# EAGLE design VFD-IV-25-5x7x2 (EAGLE 7.2.0)
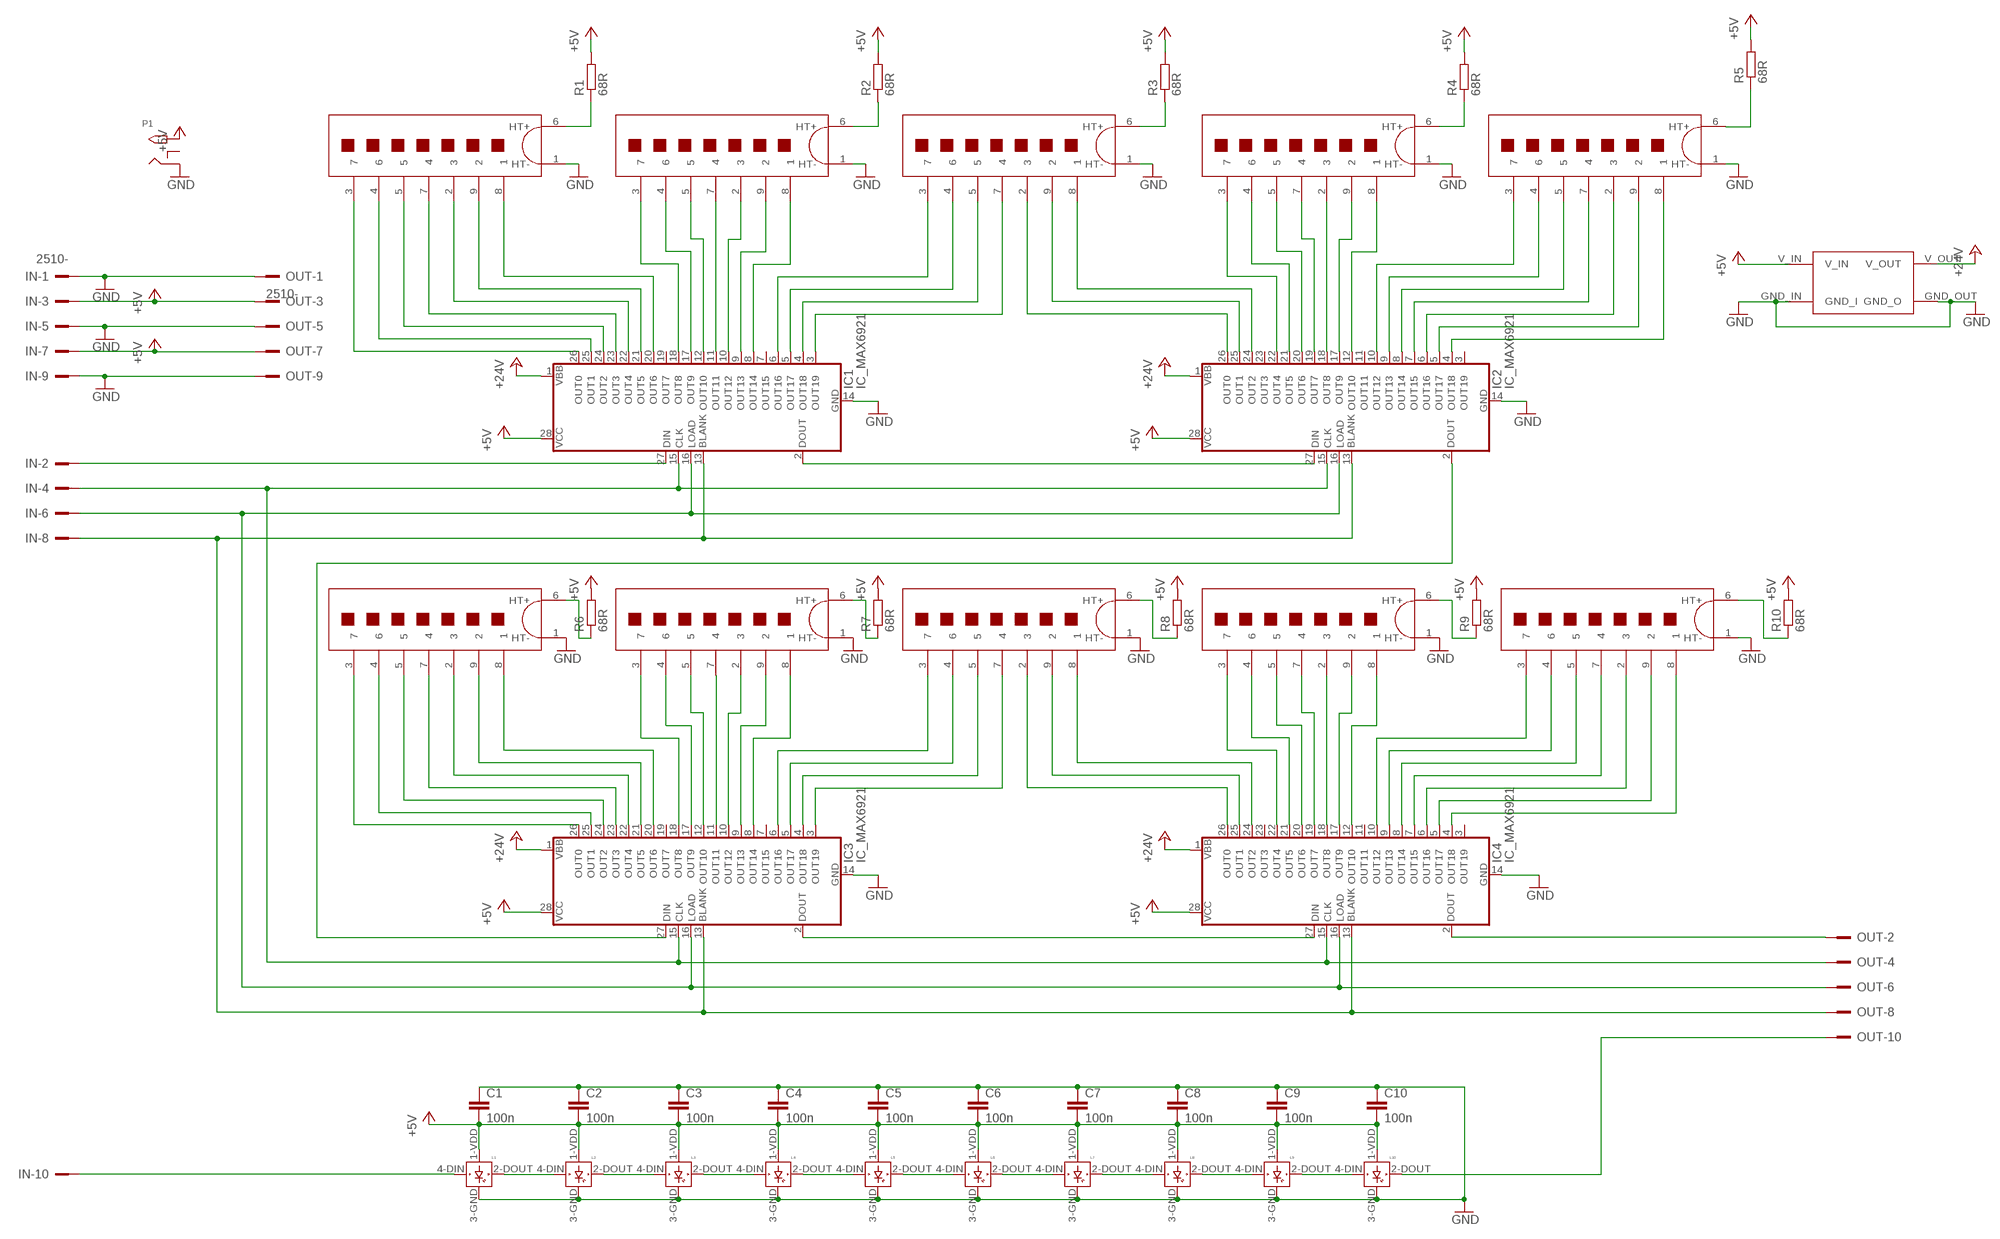
[diagram p0: schematic, sheet 1]

## Parts
1  IV-25_DISP  [IV-25]
2  IV-25_DISP  [IV-25]
3  IV-25_DISP  [IV-25]
4  IV-25_DISP  [IV-25]
5  IV-25_DISP  [IV-25]
6  IV-25_DISP  [IV-25]
7  IV-25_DISP  [IV-25]
8  IV-25_DISP  [IV-25]
9  IV-25_DISP  [IV-25]
10  IV-25_DISP  [IV-25]
C1  100n  C-EU050-025X075  [C050-025X075]
C2  100n  C-EU050-025X075  [C050-025X075]
C3  100n  C-EU050-025X075  [C050-025X075]
C4  100n  C-EU050-025X075  [C050-025X075]
C5  100n  C-EU050-025X075  [C050-025X075]
C6  100n  C-EU050-025X075  [C050-025X075]
C7  100n  C-EU050-025X075  [C050-025X075]
C8  100n  C-EU050-025X075  [C050-025X075]
C9  100n  C-EU050-025X075  [C050-025X075]
C10  100n  C-EU050-025X075  [C050-025X075]
IC1  IC_MAX6921  [S28]
IC2  IC_MAX6921  [S28]
IC3  IC_MAX6921  [S28]
IC4  IC_MAX6921  [S28]
IN  2510-  [PAK100/2500-10]
L1  WS2812B  [WS2812B]
L2  WS2812B  [WS2812B]
L3  WS2812B  [WS2812B]
L4  WS2812B  [WS2812B]
L5  WS2812B  [WS2812B]
L6  WS2812B  [WS2812B]
L7  WS2812B  [WS2812B]
L8  WS2812B  [WS2812B]
L9  WS2812B  [WS2812B]
L10  WS2812B  [WS2812B]
OUT  2510-  [PAK100/2500-10]
P1  2.1MMJACKTHM  [PJ-102A]
R1  68R  R-EU_0207/10  [0207/10]
R2  68R  R-EU_0207/10  [0207/10]
R3  68R  R-EU_0207/10  [0207/10]
R4  68R  R-EU_0207/10  [0207/10]
R5  68R  R-EU_0207/10  [0207/10]
R6  68R  R-EU_0207/10  [0207/10]
R7  68R  R-EU_0207/10  [0207/10]
R8  68R  R-EU_0207/10  [0207/10]
R9  68R  R-EU_0207/10  [0207/10]
R10  68R  R-EU_0207/10  [0207/10]
U$11  STEP_UP_MODULE  [STEP_UP_MODULE]

## Nets
+5V [power]: C1.2 C2.2 C3.2 C4.2 C5.2 C6.2 C7.2 C8.2 C9.2 C10.2 IC1.28(VCC) IC2.28(VCC) IC3.28(VCC) IC4.28(VCC) IN.3 IN.7 L1.1-VDD(VDD) L2.1-VDD(VDD) L3.1-VDD(VDD) L4.1-VDD(VDD) L5.1-VDD(VDD) L6.1-VDD(VDD) L7.1-VDD(VDD) L8.1-VDD(VDD) L9.1-VDD(VDD) L10.1-VDD(VDD) OUT.3 OUT.7 P1.TIP R1.2 R2.2 R3.2 R4.2 R5.2 R6.2 R7.2 R8.2 R9.2 R10.2 U$11.V_IN
+24V [power_lo]: IC1.1(VBB) IC2.1(VBB) IC3.1(VBB) IC4.1(VBB) U$11.V_OUT
GND [power]: 1.1(HT-) 2.1(HT-) 3.1(HT-) 4.1(HT-) 5.1(HT-) 6.1(HT-) 7.1(HT-) 8.1(HT-) 9.1(HT-) 10.1(HT-) C1.1 C2.1 C3.1 C4.1 C5.1 C6.1 C7.1 C8.1 C9.1 C10.1 IC1.14(GND) IC2.14(GND) IC3.14(GND) IC4.14(GND) IN.1 IN.5 IN.9 L1.3-GND(GND) L2.3-GND(GND) L3.3-GND(GND) L4.3-GND(GND) L5.3-GND(GND) L6.3-GND(GND) L7.3-GND(GND) L8.3-GND(GND) L9.3-GND(GND) L10.3-GND(GND) OUT.1 OUT.5 OUT.9 P1.RING U$11.GND_IN(GND_I) U$11.GND_OUT(GND_O)
N$1: L1.2-DOUT(DOUT) L2.4-DIN(DIN)
N$2: L2.2-DOUT(DOUT) L3.4-DIN(DIN)
N$3: L3.2-DOUT(DOUT) L4.4-DIN(DIN)
N$4: L4.2-DOUT(DOUT) L5.4-DIN(DIN)
N$5: L5.2-DOUT(DOUT) L6.4-DIN(DIN)
N$6: L6.2-DOUT(DOUT) L7.4-DIN(DIN)
N$7: L7.2-DOUT(DOUT) L8.4-DIN(DIN)
N$8: L8.2-DOUT(DOUT) L9.4-DIN(DIN)
N$9: L9.2-DOUT(DOUT) L10.4-DIN(DIN)
N$10: 1.3 IC1.26(OUT0)
N$11: 1.4 IC1.25(OUT1)
N$12: 1.5 IC1.24(OUT2)
N$13: 1.7 IC1.23(OUT3)
N$14: 1.2 IC1.22(OUT4)
N$15: 1.9 IC1.21(OUT5)
N$16: 1.8 IC1.20(OUT6)
N$17: 2.3 IC1.18(OUT8)
N$18: 2.4 IC1.17(OUT9)
N$19: 2.5 IC1.12(OUT10)
N$20: 2.7 IC1.11(OUT11)
N$21: 2.2 IC1.10(OUT12)
N$22: 2.9 IC1.9(OUT13)
N$23: 2.8 IC1.8(OUT14)
N$24: 3.3 IC1.6(OUT16)
N$25: 3.4 IC1.5(OUT17)
N$26: 4.3 IC2.22(OUT4)
N$27: 4.4 IC2.21(OUT5)
N$28: 3.5 IC1.4(OUT18)
N$29: 3.7 IC1.3(OUT19)
N$30: 3.2 IC2.26(OUT0)
N$31: 3.9 IC2.25(OUT1)
N$32: 3.8 IC2.24(OUT2)
N$33: 4.5 IC2.20(OUT6)
N$34: 4.7 IC2.19(OUT7)
N$35: 4.2 IC2.18(OUT8)
N$36: 4.9 IC2.17(OUT9)
N$37: 4.8 IC2.12(OUT10)
N$38: 5.3 IC2.10(OUT12)
N$39: 5.4 IC2.9(OUT13)
N$40: 5.5 IC2.8(OUT14)
N$41: 5.7 IC2.7(OUT15)
N$42: 5.2 IC2.6(OUT16)
N$43: 5.9 IC2.5(OUT17)
N$44: 5.8 IC2.4(OUT18)
N$45: 6.3 IC3.26(OUT0)
N$46: 6.4 IC3.25(OUT1)
N$47: 6.5 IC3.24(OUT2)
N$48: 6.7 IC3.23(OUT3)
N$49: 6.2 IC3.22(OUT4)
N$50: 6.9 IC3.21(OUT5)
N$51: 6.8 IC3.20(OUT6)
N$52: 7.3 IC3.18(OUT8)
N$53: 7.4 IC3.17(OUT9)
N$54: 7.5 IC3.12(OUT10)
N$55: 7.7 IC3.11(OUT11)
N$56: 7.2 IC3.10(OUT12)
N$57: 7.9 IC3.9(OUT13)
N$58: 7.8 IC3.8(OUT14)
N$59: 8.3 IC3.6(OUT16)
N$60: 8.4 IC3.5(OUT17)
N$61: 8.5 IC3.4(OUT18)
N$62: 8.7 IC3.3(OUT19)
N$63: 8.2 IC4.26(OUT0)
N$64: 8.9 IC4.25(OUT1)
N$65: 8.8 IC4.24(OUT2)
N$66: 9.3 IC4.22(OUT4)
N$67: 9.4 IC4.21(OUT5)
N$68: 9.5 IC4.20(OUT6)
N$69: 9.7 IC4.19(OUT7)
N$70: 9.2 IC4.18(OUT8)
N$71: 9.9 IC4.17(OUT9)
N$72: 9.8 IC4.12(OUT10)
N$73: 10.3 IC4.10(OUT12)
N$74: 10.4 IC4.9(OUT13)
N$75: 10.5 IC4.8(OUT14)
N$76: 10.7 IC4.7(OUT15)
N$77: 10.2 IC4.6(OUT16)
N$78: 10.9 IC4.5(OUT17)
N$79: 10.8 IC4.4(OUT18)
N$80: IC1.2(DOUT) IC2.27(DIN)
N$81: IC2.2(DOUT) IC3.27(DIN)
N$82: IC3.2(DOUT) IC4.27(DIN)
N$83: IC1.27(DIN) IN.2
N$84: IN.10 L1.4-DIN(DIN)
N$85: L10.2-DOUT(DOUT) OUT.10
N$86: IC4.2(DOUT) OUT.2
N$87: IC1.15(CLK) IC2.15(CLK) IC3.15(CLK) IC4.15(CLK) IN.4 OUT.4
N$88: IC1.16(LOAD) IC2.16(LOAD) IC3.16(LOAD) IC4.16(LOAD) IN.6 OUT.6
N$89 [power_lo]: 5.6(HT+) R5.1
N$90: IC1.13(BLANK) IC2.13(BLANK) IC3.13(BLANK) IC4.13(BLANK) IN.8 OUT.8
N$91 [power_lo]: 4.6(HT+) R4.1
N$92 [power_lo]: 3.6(HT+) R3.1
N$93 [power_lo]: 2.6(HT+) R2.1
N$94 [power_lo]: 1.6(HT+) R1.1
N$95 [power_lo]: 9.6(HT+) R9.1
N$96 [power_lo]: 10.6(HT+) R10.1
N$97 [power_lo]: 8.6(HT+) R8.1
N$98 [power_lo]: 7.6(HT+) R7.1
N$99 [power_lo]: 6.6(HT+) R6.1
Unconnected: IC1.7(OUT15) IC1.19(OUT7) IC2.3(OUT19) IC2.11(OUT11) IC2.23(OUT3) IC3.7(OUT15) IC3.19(OUT7) IC4.3(OUT19) IC4.11(OUT11) IC4.23(OUT3) P1.RING_SW

## Library data of the parts
1-10 = vfd:IV-25_DISP
C1-C10 = resistor:C-EU: CAPACITOR, European symbol
IC1-IC4 = rob:IC_MAX6921: 20-outputs, 76V, serial VFD driver Dangerousprototypes.com
IN OUT = con-3m:2510-: 3M (TM) Pak 100 4-Wall Header Source: 3M; MF: 3M; MPN: 2510-6002UB; OC_FARNELL: 9838244; OC_NEWARK: 46F4725
L1-L10 = adafruit:WS2812B
P1 = adafruit:2.1MMJACK: 2.1mm x 5.5mm THM DC jack with internal switch. Digikey part #PJ-102A, 4UCON part #05537 2.1mm x 5.5mm SMT DC jack with internal switch. Digikey part #PJ-002A-SMT, 4UCON part #03267 By microbuilder.eu & adafruit.com
R1-R10 = resistor:R-EU_: RESISTOR, European symbol
U$11 = vfd:STEP_UP_MODULE

## Net classes
1 power: width 1 mm
2 power_lo: width 0.5 mm

## Board
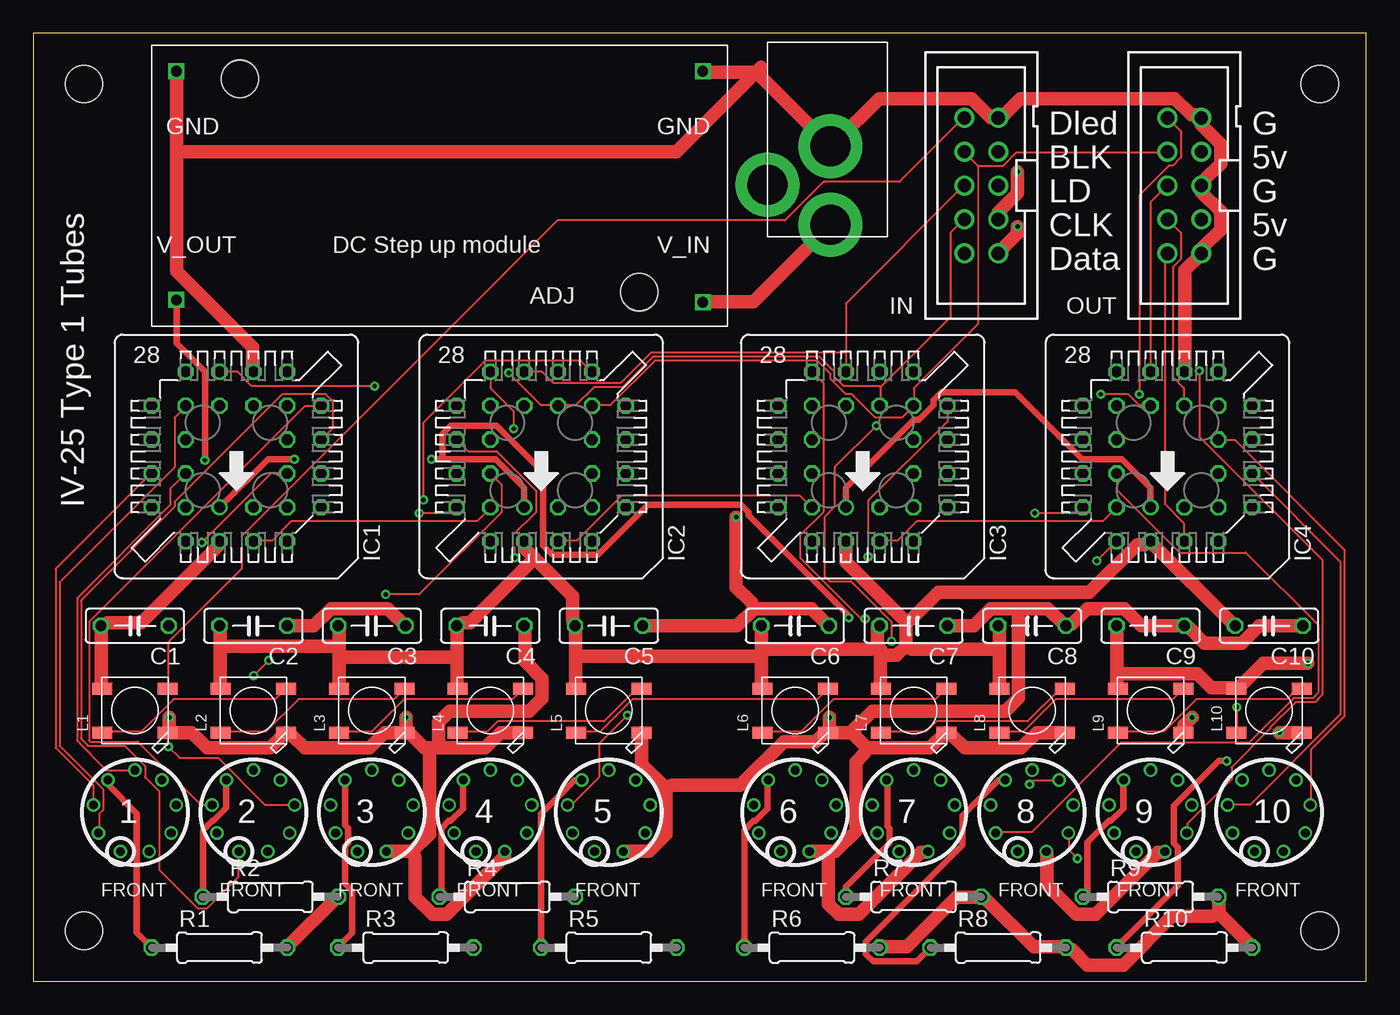
[diagram p1: board, top side]
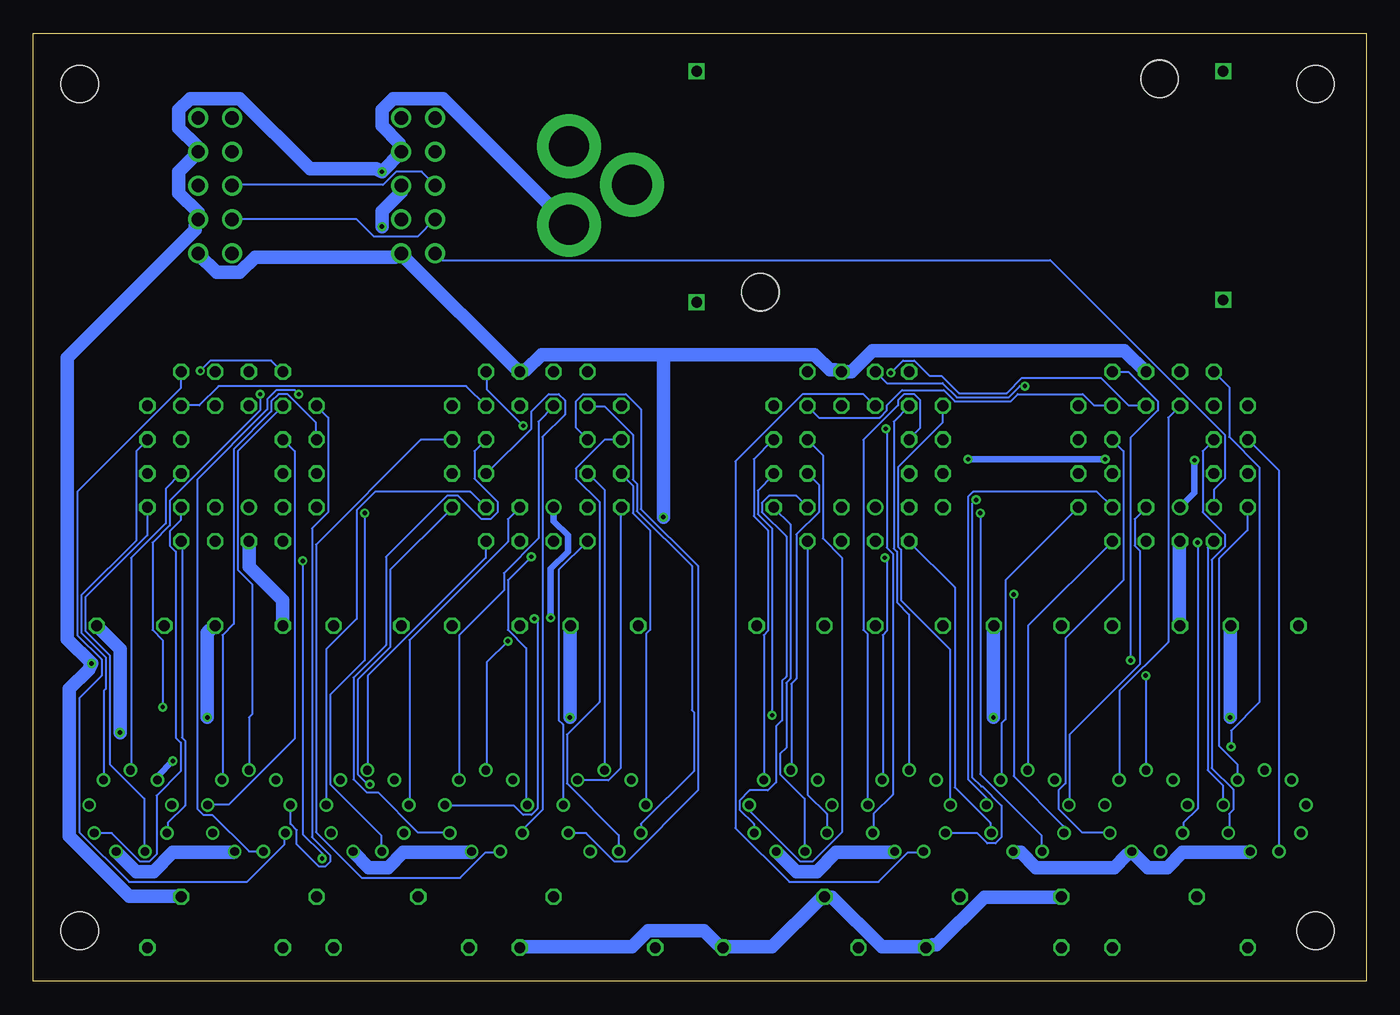
[diagram p2: board, bottom side, seen from below]

Size 100 x 71.11 mm. Coordinates in mm from the lower left corner, seen from the top.
Outline: 0,0 100,0 100,71.11 0,71.11 0,0
Copper layers (1*16): Top 0.0356mm / dielectric 1.5011mm / Bottom 0.0356mm
Design rules "oshpark-2layer": minimum track width 6mil, minimum drill 13mil, track to track 6mil, track to pad 6mil, pad to pad 6mil, via to via 6mil, smd to smd 6mil, copper to edge 15mil, drill to drill 6mil, minimum pad ring 7mil, minimum via ring 7mil, stop-mask expansion 4mil, vias tented up to drill 0mil, thermal gap 10mil
Holes 2.8 mm at 3.81,67.31 96.52,67.31 3.81,3.81 96.52,3.81 15.5,67.71 45.45,51.71

### Footprints (pad centres in the part's own frame; a part is rotated, then mirrored left to right if it is on the bottom)
IV-25 = drill 0.65: 1 1.076,-2.955; 2 2.724,-1.572; 3 3.097,0.546; 4 2.022,2.409; 5 0,3.145; 6 -2.022,2.409; 7 -3.097,0.546; 8 -2.724,-1.572; 9 -1.076,-2.955
C050-025X075 = drill 0.813 octagon: 1 -2.54,0; 2 2.54,0
S28 = drill 0.813: 1 1.27,3.81 | drill 0.813 octagon: 2 -1.27,6.35; 3 -1.27,3.81; 4 -3.81,6.35; 5 -6.35,3.81; 6 -3.81,3.81; 7 -6.35,1.27; 8 -3.81,1.27; 9 -6.35,-1.27; 10 -3.81,-1.27; 11 -6.35,-3.81; 12 -3.81,-6.35; 13 -3.81,-3.81; 14 -1.27,-6.35; 15 -1.27,-3.81; 16 1.27,-6.35; 17 1.27,-3.81; 18 3.81,-6.35; 19 6.35,-3.81; 20 3.81,-3.81; 21 6.35,-1.27; 22 3.81,-1.27; 23 6.35,1.27; 24 3.81,1.27; 25 6.35,3.81; 26 3.81,6.35; 27 3.81,3.81; 28 1.27,6.35
PAK100/2500-10 = drill 1 pad 1.422: 1 -5.08,-1.27; 2 -5.08,1.27; 3 -2.54,-1.27; 4 -2.54,1.27; 5 0,-1.27; 6 0,1.27; 7 2.54,-1.27; 8 2.54,1.27; 9 5.08,-1.27; 10 5.08,1.27
WS2812B = smd 1.5 x 0.9: 1-VDD 2.45,-1.65; 2-DOUT 2.45,1.65; 3-GND -2.45,1.65; 4-DIN -2.45,-1.65
PJ-102A = drill 3 pad 4.8: RING 0.1,-3.39; RING_SW -4.6,-6.29; TIP 0.1,-9.29
0207/10 = drill 0.813 octagon: 1 -5.08,0; 2 5.08,0
STEP_UP_MODULE = drill 0.8 square: GND_IN -19.749,-8.573; GND_OUT 19.749,-8.573; V_IN -19.749,8.753; V_OUT 19.749,8.573 | hole 2.8: -14.986,8.001; 14.986,-8.001

### Placement (x,y rotation side)
1  7.62,12.7 0 top
2  16.51,12.7 0 top
3  25.4,12.7 0 top
4  34.29,12.7 0 top
5  43.18,12.7 0 top
6  57.15,12.7 0 top
7  66.04,12.7 0 top
8  74.93,12.7 0 top
9  83.82,12.7 0 top
10  92.71,12.7 0 top
C1  7.62,26.67 180 top
C2  16.51,26.67 180 top
C3  25.4,26.67 180 top
C4  34.29,26.67 180 top
C5  43.18,26.67 180 top
C6  57.15,26.67 180 top
C7  66.04,26.67 180 top
C8  74.93,26.67 180 top
C9  83.82,26.67 180 top
C10  92.71,26.67 180 top
IC1  15.24,39.37 180 top
IC2  38.1,39.37 180 top
IC3  62.23,39.37 180 top
IC4  85.09,39.37 180 top
IN  71.12,59.69 90 top
L1  7.62,20.32 180 top
L2  16.51,20.32 180 top
L3  25.4,20.32 180 top
L4  34.29,20.32 180 top
L5  43.18,20.32 180 top
L6  57.15,20.32 180 top
L7  66.04,20.32 180 top
L8  74.93,20.32 180 top
L9  83.82,20.32 180 top
L10  92.71,20.32 180 top
OUT  86.36,59.69 90 top
P1  59.69,66.04 0 top
R1  13.97,2.54 0 top
R2  17.78,6.35 0 top
R3  27.94,2.54 0 top
R4  35.56,6.35 0 top
R5  43.18,2.54 0 top
R6  58.42,2.54 0 top
R7  66.04,6.35 0 top
R8  72.39,2.54 0 top
R9  83.82,6.35 0 top
R10  86.36,2.54 0 top
U$11  30.48,59.69 180 top

### Tracks (layer width: path | path; a pad name or v marks a point on that pad's centre or on a via)
+5V  (via drill 0.33)
  Top 1: 88.92,5.11 88.92,6.33 R9.2 | 88.92,5.11 91.44,2.59 R10.2 | R6.2 63.55,2.59 65.53,2.59 69.27,6.33 71.09,6.33 R7.2 71.55,6.1 75.06,2.59 77.42,2.59 R8.2 77.95,2.36 79.1,1.22 81.76,1.22 85.42,4.88 88.47,4.88 88.92,5.11 | R1.2 19.05,2.59 22.86,6.4 R2.2 | IN.3 72.39,57.68 73.84,59.13 v73.84,60.73 | U$11.V_IN 50.29,50.98 54.03,50.98 59.74,56.69 P1.TIP | L1.1-VDD 5.11,22.02 5.11,26.67 C1.2 5.56,26.9 8.08,26.9 13.95,32.77 13.95,32.99 IC1.28 | 14.02,25.15 14.02,26.67 C2.2 | 14.02,25.15 14.02,22.02 L2.1-VDD | 22.94,25.15 22.94,26.59 C3.2 | 22.94,25.15 22.94,24.31 | 22.94,24.31 22.94,22.02 L3.1-VDD | 31.77,24.31 31.77,26.67 C4.2 32.23,26.9 32.77,26.9 37.6,31.74 | 31.77,24.31 31.77,22.02 L4.1-VDD | 31.77,24.31 22.94,24.31 | 40.69,24.38 40.69,26.67 C5.2 40.46,27.13 40.46,28.88 37.6,31.74 | 40.69,24.38 40.69,22.02 L5.1-VDD | 37.6,31.74 36.88,32.46 36.88,32.99 IC2.28 | 22.94,25.15 14.02,25.15 | 81.31,23.09 81.31,26.67 C9.2 | 81.31,23.09 81.31,22.02 L9.1-VDD | 81.31,23.09 87.33,23.09 88.39,22.02 90.22,22.02 L10.1-VDD 90.68,22.25 92.28,23.85 v95.63,23.85 | C10.2 90.14,26.67 83.82,32.99 IC4.28 83.36,32.77 82.83,32.77 79.25,29.18 67.89,29.18 65.91,27.2 65.46,26.98 | 72.47,24.92 72.47,26.59 C8.2 | 72.47,24.92 72.47,22.02 L8.1-VDD | 54.63,24.92 54.63,26.67 C6.2 | 54.63,24.92 54.63,24.38 | 54.63,24.38 54.63,22.02 L6.1-VDD | 63.55,24.46 63.55,24.92 63.32,25.15 | 63.55,24.46 63.55,22.02 L7.1-VDD | 63.32,25.15 63.32,26.52 63.48,26.67 C7.2 | IC3.28 60.96,31.47 65.46,26.98 | 65.46,25.15 65.46,26.98 | 65.46,25.15 64.77,24.46 63.55,24.46 | 54.63,24.92 62.87,24.92 63.32,25.15 | 72.47,24.92 65.91,24.92 65.46,25.15
  Top 1: 54.63,24.38 40.69,24.38
  Bottom 1: R2.2 22.86,6.33 28.65,6.33 32.23,2.74 32.54,2.74 R3.2 33.07,2.59 36.35,2.59 40.08,6.33 40.62,6.33 R4.2 41.07,6.1 44.58,2.59 48.23,2.59 R5.2 48.69,2.82 49.68,3.81 53.87,3.81 55.09,2.59 63.48,2.59 R6.2 | P1.TIP 59.82,56.77 69.27,66.22 73,66.22 73.84,65.38 73.84,64.16 72.54,62.87 72.54,62.71 IN.7 72.39,62.18 v73.84,60.73 74.3,60.96 79.25,60.96 84.51,66.22 88.24,66.22 89.08,65.38 89.08,64.01 87.78,62.71 OUT.7 87.63,62.18 89.08,60.73 89.08,59.13 87.63,57.68 OUT.3 87.86,56.69 87.86,56.39 97.46,46.79 97.46,25.68 v95.63,23.85 95.86,23.39 97.31,21.95 97.31,10.9 92.81,6.4 88.92,6.4 R9.2 | IC1.28 14.02,32.99 14.02,26.67 C2.2 | IC4.28 83.82,31.09 81.31,28.57 81.31,26.67 C9.2
+24V  (via drill 0.33)
  Top 0.5: IC3.1 60.96,37.03 66.06,42.14 66.45,42.14 67.51,43.2 67.51,43.59 68.12,44.2 73.69,44.2 78.72,39.17 81.69,39.17 83.82,37.03 IC4.1 | v12.88,39.09 12.88,45.72 10.74,47.85 10.74,51.05 U$11.V_OUT | v29.87,39.17 30.71,39.17 | 30.71,39.17 34.67,39.17 36.8,37.03 36.8,35.59 IC2.1 | v19.58,39.17 17.6,39.17 14.02,35.59 IC1.1 | v61.19,27.28 61.19,27.43 53.65,34.98 53.65,35.2 53.11,35.74 46.1,35.74 42.37,32 38.94,32 38.25,32.69 38.25,38.18 34.75,41.68 31.32,41.68 30.71,41.07 30.71,39.17
  Bottom 0.5: v12.88,39.09 12.88,36.65 IC1.1 | v19.58,39.17 v29.87,39.17 | IC3.1 60.96,34.52 59.89,33.45 59.89,32.23 61.19,30.94 v61.19,27.28
GND  (via drill 0.33)
  Top 1: U$11.GND_OUT 10.74,68.2 10.74,53.26 16.46,47.55 16.46,45.72 IC1.14 | v73.84,56.62 73.84,56.08 72.39,54.63 IN.1 | IC4.14 86.41,45.72 86.41,53.34 87.63,54.56 OUT.1 87.78,55.09 89.08,56.39 89.08,57.76 87.63,59.21 OUT.5 87.86,60.12 89.08,61.34 89.08,62.79 87.63,64.24 OUT.9 87.17,65 86.87,65 85.65,66.22 74.07,66.22 72.85,65 IN.9 71.86,64.77 70.41,66.22 63.48,66.22 60.2,62.94 P1.RING 59.74,62.71 54.25,68.2 50.29,68.2 U$11.GND_IN | 47.47,14.48 45.64,16.31 45.64,18.67 L5.3-GND | 47.47,14.48 47.47,11.05 46.18,9.75 44.27,9.75 5.1 | C2.1 21.03,26.67 22.33,27.96 26.59,27.96 27.89,26.67 C3.1 | 10.21,18.67 11.89,18.67 13.03,17.53 17.75,17.53 18.9,18.67 L2.3-GND 19.43,18.44 20.34,17.53 25.22,17.53 26.36,18.67 27.81,18.67 | 10.21,18.67 10.13,18.67 L1.3-GND | 27.81,18.67 L3.3-GND 28.35,18.52 29.34,17.53 29.72,17.53 | 29.72,17.53 30.4,17.53 | 30.4,17.53 33.91,17.53 35.05,18.67 36.73,18.67 L4.3-GND | 10.21,18.67 v10.21,19.81 | 30.4,17.53 30.4,19.43 31.24,20.27 37.19,20.27 38.18,21.26 38.18,22.71 36.88,24 36.88,26.67 C4.1 | v27.96,19.81 27.96,19.13 27.81,18.67 | 28.42,9.75 26.52,9.75 3.1 | 28.42,9.75 29.72,11.05 29.72,17.53 | 4.1 35.36,9.68 35.36,9.37 31.01,5.03 29.95,5.03 28.65,6.33 28.65,9.3 28.42,9.75 | v93.5,18.67 95.1,18.67 L10.3-GND | v86.94,19.81 86.33,19.2 86.33,18.75 L9.3-GND | C7.1 70.56,26.67 71.86,27.96 73.91,27.96 | 73.91,27.96 76.12,27.96 77.42,26.67 C8.1 77.95,26.82 79.1,27.96 81.84,27.96 83.13,26.67 C9.1 86.79,26.44 87.86,25.38 90.68,25.38 91.97,26.67 C10.1 | C5.1 52.81,26.67 54.1,27.96 | 54.1,27.96 58.37,27.96 59.66,26.67 C6.1 | 61.42,18.67 59.74,18.67
  Top 1: 59.74,18.67 59.66,18.67 L6.3-GND 59.13,18.44 58.67,17.98 56.31,17.98 53.03,14.71 47.93,14.71 47.47,14.48 | 62.56,17.53 61.42,18.67 | 62.56,17.53 67.28,17.53 68.43,18.67 L7.3-GND 68.96,18.44 69.88,17.53 74.14,17.53 75.29,18.67 77.34,18.67 L8.3-GND | 59.66,9.75 60.2,9.75 61.72,11.28 61.72,16.46 62.33,17.07 62.56,17.53 | 59.66,9.75 58.29,9.75 6.1 | 59.66,9.75 59.66,5.79 60.43,5.03 61.95,5.03 66.6,9.68 67.06,9.68 7.1 | 9.1 84.89,9.68 84.35,9.68 79.7,5.03 78.26,5.03 76.05,7.24 76.05,9.68 8.1 | 59.74,18.67 v59.74,19.81 | 73.91,27.96 73.91,21.26 72.92,20.27 62.94,20.27 61.72,19.05 61.42,18.67 | v52.73,34.82 52.73,29.57 53.87,28.42 54.1,27.96
  Bottom 1: IC1.14 16.54,45.72 18.14,47.32 37.03,47.32 38.63,45.72 IC2.14 39.85,45.87 40.23,45.87 41.38,47.02 52.73,47.02 | IN.5 72.39,59.21 73.84,57.76 v73.84,56.62 | OUT.1 87.63,54.56 86.26,53.19 84.51,53.19 83.36,54.33 72.85,54.33 IN.1 72.39,54.56 63.55,45.72 IC3.14 63.02,45.87 61.87,47.02 52.73,47.02 | 4.1 35.43,9.68 39.78,9.68 41.22,8.23 42.75,8.23 44.2,9.68 5.1 | 1.1 8.76,9.68 13.79,9.68 14.94,8.53 16.38,8.53 17.53,9.68 2.1 17.98,9.45 18.9,8.53 24.77,8.53 25.91,9.68 26.44,9.68 3.1 | v10.21,19.81 10.21,26.67 C1.1 | v27.96,19.81 27.96,26.67 C3.1 | v93.5,18.67 93.5,24.92 C10.1 | v86.94,19.81 86.94,26.14 86.41,26.67 C9.1 | 9.1 84.96,9.68 89.53,9.68 90.98,8.23 92.28,8.23 93.73,9.68 10.1 | 7.1 67.13,9.68 72.24,9.68 73.38,8.53 74.83,8.53 75.97,9.68 8.1 | v59.74,19.81 59.74,26.67 C6.1 | v52.73,34.82 52.73,47.02
N$1
  Top 0.152: L1.2-DOUT 5.18,18.75 8.08,18.75 10.52,21.18 18.14,21.18 18.9,21.95 L2.4-DIN
N$2
  Top 0.152: L2.2-DOUT 14.1,18.75 17.45,18.75 19.89,21.18 27.05,21.18 27.81,21.95 L3.4-DIN
N$3
  Top 0.152: L3.2-DOUT 23.01,18.75 25.38,18.75 27.81,21.18 35.97,21.18 36.73,21.95 L4.4-DIN
N$4
  Top 0.152: L4.2-DOUT 31.85,18.75 34.06,18.75 34.82,19.51 42.82,19.51 45.26,21.95 45.57,21.95 L5.4-DIN
N$5
  Top 0.152: L5.2-DOUT 40.77,18.75 42.52,18.75 44.96,21.18 58.83,21.18 59.59,21.95 L6.4-DIN
N$6
  Top 0.152: L6.2-DOUT 54.71,18.75 57.61,18.75 60.05,21.18 67.67,21.18 68.43,21.95 L7.4-DIN
N$7
  Top 0.152: L7.2-DOUT 63.63,18.75 66.98,18.75 67.74,19.51 74.6,19.51 77.04,21.95 77.34,21.95 L8.4-DIN
N$8
  Top 0.152: L8.2-DOUT 72.54,18.75 74.3,18.75 76.73,21.18 85.5,21.18 86.26,21.95 L9.4-DIN
N$9
  Top 0.152: L9.2-DOUT 81.38,18.75 84.81,18.75 87.25,21.18 94.03,21.18 94.79,21.95 95.1,21.95 L10.4-DIN
N$10
  Bottom 0.152: 1.3 10.74,13.26 10.74,14.71 11.89,15.85 11.89,32.54 11.43,32.99 IC1.26
N$11
  Bottom 0.152: 1.4 9.68,15.16 9.68,16.31 11.05,17.68 11.05,31.7 8.91,33.83 8.91,35.51 IC1.25
N$12
  Top 0.152: IC1.24 10.29,36.96 10.29,35.74 3.28,28.73 3.28,18.06 5.49,15.85 1.5
N$13
  Top 0.152: 1.7 4.5,13.26 4.5,14.71 1.68,17.53 1.68,30.94 8.84,38.1 IC1.23
N$14
  Bottom 0.152: 1.2 10.29,11.2 10.29,12.57 9.98,12.88 9.98,14.4 11.58,16 11.58,31.62 10.59,32.61 10.59,33.53 12.27,35.2 12.27,39.78 11.43,40.62 IC1.22
N$15
  Bottom 0.152: 1.9 6.55,9.75 6.55,38.33 8.84,40.62 IC1.21
N$16
  Top 0.152: 1.8 4.95,11.2 4.95,12.57 5.26,12.88 5.26,14.4 1.98,17.68 1.98,29.95 10.59,38.56 10.59,42.29 11.43,43.13 IC1.20
N$17  (via drill 0.33)
  Top 0.152: v10.13,17.6 10.97,16.76 13.87,16.76 17.37,13.26 19.58,13.26 2.3
  Bottom 0.152: v10.13,17.6 10.13,18.82 8,20.95 8,38.56 10.29,40.84 10.29,44.58 IC1.18
N$18
  Bottom 0.152: IC1.17 14.86,42.29 14.86,25.45 18.52,21.79 18.52,15.16 2.4
N$19  (via drill 0.33)
  Top 0.152: v17.68,24.08 v16.54,22.94
  Bottom 0.152: v16.54,22.94 16.54,15.85 2.5 | v17.68,24.08 17.68,40.77 15.62,42.82 15.62,43.51 17.83,45.72 IC1.12
N$20
  Top 0.152: 2.7 12.57,13.26 7.85,17.98 4.27,17.98 4.19,18.06 4.19,26.98 20.34,43.13 21.57,43.13 IC1.11
N$21
  Bottom 0.152: 2.2 19.28,11.2 21.34,11.2 23.09,12.95 23.09,14.33 22.55,14.86 22.55,25.76 18.21,30.1 18.21,39.78 19.05,40.62 IC1.10
N$22
  Top 0.152: IC1.9 22.48,41.53 22.48,43.51 21.95,44.04 18.67,44.04 10.59,35.97 10.59,35.59 3.58,28.57 3.58,18.21 4.12,17.68 6.86,17.68 8.38,16.15 8.38,15.32 9.45,14.25 9.45,8.38 12.34,5.49 13.03,5.49 15.39,7.85 15.39,9.68 2.9
N$23  (via drill 0.33)
  Top 0.152: v12.65,32.92 17.83,38.1 IC1.8
  Bottom 0.152: v12.65,32.92 12.65,12.95 13.72,11.89 13.72,11.2 2.8
N$24
  Bottom 0.152: 3.3 28.5,13.79 29.87,15.16 29.87,36.35 29.49,36.73 20.19,36.73 19.05,35.59 IC1.6
N$25
  Bottom 0.152: IC1.5 27.05,30.1 27.05,19.66 27.36,19.36 27.36,15.16 3.4
N$26
  Bottom 0.152: 4.3 37.41,13.26 37.41,26.06 37.72,26.36 37.72,40.62 35.13,43.2 35.13,43.59 34.67,44.04 33.91,44.04 33.45,43.59 33.45,41.53 34.29,40.69 IC2.22
N$27  (via drill 0.33)
  Top 0.152: v36.12,31.77 36.12,32.54 35.97,32.69 35.97,33.45 37.72,35.2 37.72,36.8 34.75,39.78 32.61,39.78 IC2.21
  Bottom 0.152: v36.12,31.77 35.97,31.62 35.97,26.29 36.27,25.98 36.27,15.16 4.4
N$28
  Bottom 0.152: 3.5 25.38,15.85 25.38,26.67 19.05,32.99 IC1.4
N$29
  Bottom 0.152: 3.7 22.25,13.26 22.25,18.52 16.99,23.77 16.99,32.31 17.37,32.69 17.37,34.67 16.54,35.51 IC1.3
N$30
  Bottom 0.152: 3.2 28.19,11.2 28.19,11.89 30.86,14.55 30.86,29.57 34.29,32.99 IC2.26
N$31  (via drill 0.33)
  Top 0.152: v28.96,35.13 31.32,35.13 IC2.25
  Bottom 0.152: v28.96,35.13 28.96,15.54 24.38,10.97 24.38,9.75 3.9
N$32  (via drill 0.33)
  Top 0.152: v26.44,29.03 28.96,29.03 35.13,35.2 35.13,37.26 IC2.24
  Bottom 0.152: v26.44,29.03 26.44,15.39 22.71,11.66 22.71,11.2 3.8
N$33
  Bottom 0.152: 4.5 34.29,27.51 35.2,28.42 35.2,32.23 35.43,32.46 35.43,41.99 34.29,43.13 IC2.20
N$34
  Bottom 0.152: 4.7 31.24,13.26 31.24,24.92 34.9,28.57 34.9,32.38 35.13,32.61 35.13,38.56 31.77,41.91 31.77,43.13 IC2.19
N$35  (via drill 0.33)
  Top 0.152: v36.04,41.45 36.04,42.75 34.29,44.5 IC2.18
  Bottom 0.152: v36.04,41.45 35.97,41.38 35.97,32.54 35.51,32.08 35.51,14.02 36.96,12.57 36.96,11.2 4.2
N$36
  Bottom 0.152: 4.9 33.22,9.68 34.37,9.68 36.58,7.47 43.28,7.47 47.32,11.51 47.32,39.01 42.29,44.04 37.72,44.04 36.88,43.2 IC2.17
N$37  (via drill 0.33)
  Top 0.152: v29.26,36.12 29.26,41.91 33.91,46.56 41.07,46.56 IC2.12
  Bottom 0.152: v29.26,36.12 29.57,35.81 29.57,15.32 28.88,14.63 28.8,14.63 27.36,13.18 27.36,10.82 27.81,10.36 28.42,10.36 29.18,11.12 31.55,11.12 4.8
N$38
  Bottom 0.152: 5.3 46.25,13.18 46.25,12.8 42.44,8.99 41.53,8.99 39.32,11.2 39.32,31.77 40.77,33.22 40.77,39.47 41.91,40.62 IC2.10
N$39
  Bottom 0.152: 5.4 45.19,15.16 45.19,25.98 44.88,26.29 44.88,33.83 45.95,34.9 45.95,39.17 44.5,40.62 IC2.9
N$40
  Bottom 0.152: IC2.8 41.07,37.26 41.07,35.2 42.75,33.53 42.75,22.71 43.13,22.33 43.13,15.85 5.5
N$41  (via drill 0.33)
  Top 0.152: v44.58,19.96 42.44,17.83 42.44,15.32 40.39,13.26 40.16,13.26 5.7
  Bottom 0.152: v44.58,19.96 44.58,33.98 45.64,35.05 45.64,36.8 44.5,37.95 44.5,38.1 IC2.7
N$42
  Bottom 0.152: 5.2 45.95,11.2 45.95,11.81 47.02,12.88 47.02,13.56 46.25,14.33 44.88,14.33 44.27,14.94 44.27,19.13 43.81,19.58 43.81,22.55 43.51,22.86 43.51,33.38 45.34,35.2 45.34,35.89 44.81,36.42 42.75,36.42 41.91,35.59 IC2.6
N$43
  Bottom 0.152: 5.9 42.14,9.75 42.14,13.72 43.97,15.54 43.97,17.07 43.51,17.53 43.51,22.4 43.2,22.71 43.2,34.29 44.42,35.51 IC2.5
N$44
  Bottom 0.152: IC2.4 41.91,14.02 40.46,12.57 40.46,11.2 5.8
N$45
  Bottom 0.152: IC3.26 60.58,30.86 60.58,19.58 60.27,19.28 60.27,13.26 6.3
N$46
  Bottom 0.152: 6.4 59.13,15.09 56.84,15.09 55.93,16 55.93,35.51 IC3.25
N$47
  Bottom 0.152: 6.5 57.15,36.88 58.37,38.1 IC3.24
N$48
  Bottom 0.152: 6.7 54.03,13.26 54.03,26.06 53.72,26.36 53.72,33.83 55.02,35.13 55.02,37.19 55.93,38.1 IC3.23
N$49
  Bottom 0.152: 6.2 59.82,11.12 58.52,11.12 56.39,8.99 55.47,8.99 50.14,14.33 50.14,31.17 54.41,35.43 54.41,42.9 55.55,44.04 58.75,44.04 59.28,43.51 59.28,41.53 58.45,40.69 IC3.22
N$50
  Bottom 0.152: 6.9 56.08,9.75 56.08,10.97 59.97,14.86 59.97,18.52 57.53,20.95 57.53,35.97 59.28,37.72 59.28,38.48 57.15,40.62 55.93,40.62 IC3.21
N$51
  Bottom 0.152: 6.8 54.41,11.2 54.41,11.81 50.44,15.77 50.44,20.19 50.6,20.34 50.6,31.17 54.71,35.28 54.71,37.34 55.02,37.64 55.02,41 57.15,43.13 58.37,43.13 IC3.20
N$52  (via drill 0.33)
  Top 0.152: v62.41,27.2 62.1,27.2 57.53,31.77 57.53,33.45 59.28,35.2 59.28,44.88 58.45,45.72 IC3.18
  Bottom 0.152: v62.41,27.2 62.18,26.98 62.18,12.95 62.64,12.5 63.25,12.5 63.93,13.18 69.11,13.18 7.3
N$53
  Bottom 0.152: 7.4 68.05,15.16 68.05,25.98 64.69,29.34 64.69,30.63 62.1,33.22 62.1,41.99 60.96,43.13 IC3.17
N$54  (via drill 0.33)
  Top 0.152: v64.39,25.53 64.39,26.98 61.34,30.02 59.74,30.02 59.36,30.4 59.36,34.82 60.12,35.59 60.12,38.56 v63.25,41.68
  Bottom 0.152: v64.39,25.53 65.99,23.93 65.99,15.85 7.5 | v63.25,41.68 65.99,44.42 65.99,45.72 IC3.12
N$55  (via drill 0.33)
  Top 0.152: v62.64,31.85 62.64,36.04 68.58,41.99 IC3.11
  Bottom 0.152: v62.64,31.85 64.39,30.1 64.39,26.36 63.02,24.99 63.02,13.26 7.7
N$56
  Bottom 0.152: IC3.10 66.9,39.78 66.9,37.72 65.15,35.97 65.15,35.2 65.68,34.67 66.37,34.67 68.12,36.42 68.96,36.42 73.53,31.85 73.53,25.22 75.97,22.78 75.97,15.16 74.98,14.17 74.14,14.17 71.17,11.2 68.81,11.2 7.2
N$57
  Bottom 0.152: 7.9 65,9.68 66.06,9.68 67.97,7.77 75.36,7.77 78.79,11.2 78.79,32.77 70.94,40.62 68.58,40.62 IC3.9
N$58
  Bottom 0.152: 7.8 63.25,11.2 63.25,11.43 61.8,12.88 61.8,40.84 60.12,42.52 60.12,43.59 60.58,44.04 61.34,44.04 62.64,42.75 62.64,41.45 65.99,38.1 IC3.8
N$59
  Bottom 0.152: IC3.6 67.21,36.73 74.37,36.73 75.74,35.36 75.74,27.2 78.03,24.92 8.3
N$60  (via drill 0.33)
  Top 0.152: v74.75,14.78 75.06,15.09 76.89,15.09 8.4
  Bottom 0.152: v74.75,14.78 74.91,14.78 75.67,15.54 75.67,22.63 73.23,25.07 73.23,30.86 68.58,35.51 IC3.5
N$61
  Bottom 0.152: 8.5 74.91,15.85 74.91,22.94 66.06,31.77 66.06,32.99 IC3.4
N$62
  Bottom 0.152: IC3.3 64.39,34.67 64.39,32.99 71.78,25.6 71.78,13.26 8.7
N$63  (via drill 0.33)
  Top 0.152: v78.33,9.22 77.72,9.83 77.72,11.12 8.2 | v79.78,31.55 81.23,32.99 IC4.26
  Bottom 0.152: v78.33,9.22 78.33,9.6 79.78,11.05 v79.78,31.55
N$64  (via drill 0.33)
  Top 0.152: v75.13,35.13 78.33,35.13 78.72,35.51 IC4.25
  Bottom 0.152: v75.13,35.13 75.13,24.08 77.72,21.49 77.72,14.78 73.91,10.97 73.91,9.75 8.9
N$65
  Top 0.152: 8.8 72.24,11.2 74.91,11.2 81.61,17.91 91.21,17.91 94.56,21.26 96.01,21.26 96.39,21.64 96.39,26.75 90.98,32.16 86.03,32.16 81.31,36.88 81.31,38.1 IC4.24
N$66
  Bottom 0.152: 9.3 86.87,13.26 85.34,13.26 80.39,18.21 80.39,39.78 81.23,40.62 IC4.22
N$67
  Bottom 0.152: 9.4 85.8,15.16 85.8,25.98 84.96,26.82 84.96,39.93 82.14,42.75 82.14,43.51 81.61,44.04 80.92,44.04 78.79,41.91 78.79,40.69 IC4.21
N$68
  Bottom 0.152: 9.5 83.82,19.81 83.59,20.04 83.59,29.79 84.66,30.86 84.66,39.78 81.31,43.13 IC4.20
N$69
  Bottom 0.152: 9.7 80.7,13.18 80.7,11.81 80.24,11.35 80.24,10.29 78.56,8.61 78.11,8.61 77.72,8.99 77.72,9.45 79.1,10.82 79.1,33.98 77.88,35.2 77.88,42.29 78.72,43.13 IC4.19
N$70  (via drill 0.33)
  Top 0.152: v87.48,45.8 87.48,40.84 96.7,31.62 96.7,21.49 96.16,20.95 94.72,20.95 92.81,19.05 92.81,18.97 89.92,16.08 89.92,15.16 86.56,11.81 86.56,11.2 9.2
  Bottom 0.152: v87.48,45.8 86.72,46.56 82.14,46.56 81.31,45.72 IC4.18
N$71  (via drill 0.33)
  Top 0.152: v80.09,44.04 82.14,44.04 82.98,43.2 83.82,43.2 IC4.17
  Bottom 0.152: v80.09,44.04 80.39,44.35 81.76,44.35 82.45,43.66 82.45,42.9 87.71,37.64 87.71,12.95 87.25,12.5 86.56,12.5 83.82,9.75 82.75,9.75 9.9
N$72
  Bottom 0.152: 9.8 81.15,11.12 81.15,10.29 83.97,7.47 92.81,7.47 96.55,11.2 96.55,21.26 94.87,22.94 94.87,24.16 96.7,25.98 96.7,36.73 88.92,44.5 88.92,45.72 IC4.12
N$73
  Top 0.152: 10.3 95.86,13.26 95.86,17.37 98.37,19.89 98.37,32.38 90.14,40.62 88.92,40.62 IC4.10
N$74
  Bottom 0.152: 10.4 94.72,15.16 94.72,21.79 94.56,21.95 94.56,24.31 96.39,26.14 96.39,28.96 92.28,33.07 92.28,39.78 91.44,40.62 IC4.9
N$75
  Bottom 0.152: 10.5 92.66,15.85 92.66,31.77 90.07,34.37 90.07,36.96 88.92,38.1 IC4.8
N$76
  Top 0.152: IC4.7 98.07,31.47 98.07,20.04 91.29,13.26 89.69,13.26 10.7
N$77
  Bottom 0.152: 10.2 95.4,11.12 94.11,11.12 91.97,8.99 91.29,8.99 90.75,9.53 90.75,13.95 88.92,15.77 88.92,17.91 89.31,18.29 89.31,32.23 89.76,32.69 89.76,33.76 88.92,34.59 88.92,35.51 IC4.6
N$78
  Bottom 0.152: IC4.5 91.44,33.45 96.09,28.8 96.09,26.29 94.26,24.46 94.26,16.31 91.67,13.72 91.67,9.75 10.9
N$79
  Bottom 0.152: 10.8 89.92,11.2 89.92,11.89 88.62,13.18 88.62,18.06 88.85,18.29 88.85,32.99 IC4.4
N$80
  Top 0.152: IC1.2 16.54,33.07 17.91,33.07 19.36,34.52 33.3,34.52 34.29,35.51 IC2.27
N$81
  Top 0.152: IC2.2 39.4,33.07 40.77,33.07 44.12,36.42 57.53,36.42 58.37,35.59 IC3.27
N$82
  Top 0.152: IC4.27 80.24,34.52 66.29,34.52 64.85,33.07 63.55,33.07 IC3.2
N$83
  Bottom 0.152: IC1.27 11.43,36.88 10.59,37.72 10.59,41 23.7,54.1 69.34,54.1 IN.2
N$84
  Top 0.152: L1.4-DIN 10.13,22.02 10.13,25.45 15.62,30.94 15.62,33.38 39.32,57.07 56.39,57.07 59.28,59.97 65,59.97 69.8,64.77 IN.10
N$85  (via drill 0.33)
  Top 0.152: v90.3,20.57 90.3,18.75 L10.2-DOUT | v82.98,44.04 82.98,58.98 85.19,61.19 85.5,61.19 86.11,61.8 86.11,63.78 85.11,64.77 OUT.10
  Bottom 0.152: v90.3,20.57 90.3,25.6 91.06,26.36 91.06,32.92 89.76,34.21 89.76,36.04 82.98,42.82 v82.98,44.04
N$86
  Top 0.152: OUT.2 84.89,54.41 84.89,35.81 86.33,34.37 86.33,33.07 IC4.2
N$87  (via drill 0.33)
  Top 0.152: v35.66,45.64 38.1,43.2 39.32,43.2 IC2.15 39.4,43.2 40.69,43.2 42.06,44.58 44.2,44.58 46.48,46.86 58.98,46.86 60.12,45.72 60.12,45.34 60.81,44.65 63.55,44.65 63.59,44.62 | IC4.15 86.33,43.2 86.33,44.5 85.5,45.34 85.5,53.57 86.11,54.18 86.11,56.16 85.11,57.15 OUT.4 | 63.59,44.62 68.81,49.84 68.81,56.16 69.8,57.15 IN.4 | 63.59,44.62 63.55,44.58 63.55,43.2 IC3.15
  Bottom 0.152: v35.66,45.64 34.75,46.56 33.91,46.56 32.77,45.41 31.85,45.41 30.56,44.12 26.98,44.12 25.83,45.26 19.89,45.26 17.83,43.2 16.54,43.2 IC1.15 | OUT.4 75.74,57.15 74.45,55.85 71.17,55.85 69.88,57.15 IN.4
N$88  (via drill 0.33)
  Top 0.152: IC1.16 15.32,45.72 16.38,44.65 v25.6,44.65 | IC4.16 83.82,58.45 85.04,59.66 OUT.6 | 60.96,47.17 60.96,50.83 69.8,59.66 IN.6 | 60.96,47.17 IC3.16 | IC2.16 38.18,45.72 39.01,44.88 44.04,44.88 46.33,47.17 60.96,47.17
  Bottom 0.152: v25.6,44.65 25.98,44.65 26.82,43.81 30.71,43.81 31.77,44.88 35.97,44.88 36.8,45.72 IC2.16 | OUT.6 85.04,59.74 73.76,59.74 72.77,60.73 70.87,60.73 69.88,59.74 IN.6
N$89
  Top 0.5: R5.1 38.1,12.57 40.62,15.09 41.15,15.09 5.6
N$90
  Top 0.152: 70.87,61.19 70.87,49.3 66.06,44.5 66.06,43.2 IC3.13 65.15,42.29 63.17,42.29 61.42,44.04 60.96,44.04 59.82,45.19 59.82,45.57 58.83,46.56 46.63,46.56 43.28,43.2 41.91,43.2 IC2.13 | 70.87,61.19 69.88,62.18 IN.8 | 70.87,61.19 72.77,61.19 73.76,62.18 85.04,62.18 OUT.8
  Bottom 0.152: IC1.13 19.05,43.2 20.42,43.2 21.26,44.04 26.14,44.04 26.67,43.51 30.86,43.51 31.7,44.35 34.82,44.35 35.97,43.2 35.97,42.82 36.5,42.29 41.07,42.29 41.91,43.13 IC2.13 | IC3.13 67.51,44.65 86.11,44.65 87.55,43.2 88.85,43.2 IC4.13
N$91
  Top 0.5: 4.6 32.23,15.09 32.23,12.95 31.32,12.04 31.17,12.04 30.63,11.51 30.63,6.55 30.48,6.4 R4.1
N$92
  Top 0.5: 3.6 23.39,15.09 23.39,11.73 23.62,11.51 23.62,10.36 23.39,10.13 23.39,7.32 23.93,6.78 23.93,3.66 22.86,2.59 R3.1
N$93
  Top 0.5: 2.6 14.48,15.09 14.48,13.03 13.49,12.04 13.41,12.04 12.72,11.35 12.72,6.4 R2.1
N$94
  Top 0.5: R1.1 7.77,3.66 7.77,12.57 5.64,14.71 5.64,15.09 1.6
N$95
  Top 0.5: R9.1 79.1,6.71 79.1,10.44 80.7,12.04 80.85,12.04 81.76,12.95 81.76,15.09 9.6
N$96  (via drill 0.33)
  Top 0.5: v89.53,16.54 88.92,16.54 85.57,13.18 85.57,10.36 85.88,10.06 85.88,7.16 81.31,2.59 R10.1
  Bottom 0.5: v89.53,16.54 90.68,15.39 90.68,15.16 10.6
N$97
  Top 0.5: R8.1 66.29,1.52 63.02,1.52 62.48,2.06 62.48,2.97 69.72,10.21 69.72,12.42 72.39,15.09 72.85,15.09 8.6
N$98
  Top 0.5: R7.1 60.96,7.09 64.24,10.36 64.24,11.51 64.08,11.66 64.08,15.09 7.6
N$99
  Top 0.5: R6.1 53.34,11.35 54.03,12.04 54.18,12.04 55.09,12.95 55.09,15.09 6.6
N$100
  Top 1.016: 11.43,62.23 48.26,62.23 54.61,68.58

### Text on the board
tPlace: Dled | G | BLK | 5v | LD | G | CLK | 5v | Data | G | IV-25 Type 1 Tubes